# Altium project F405Flyer-ZK-v0.1.PrjPcb
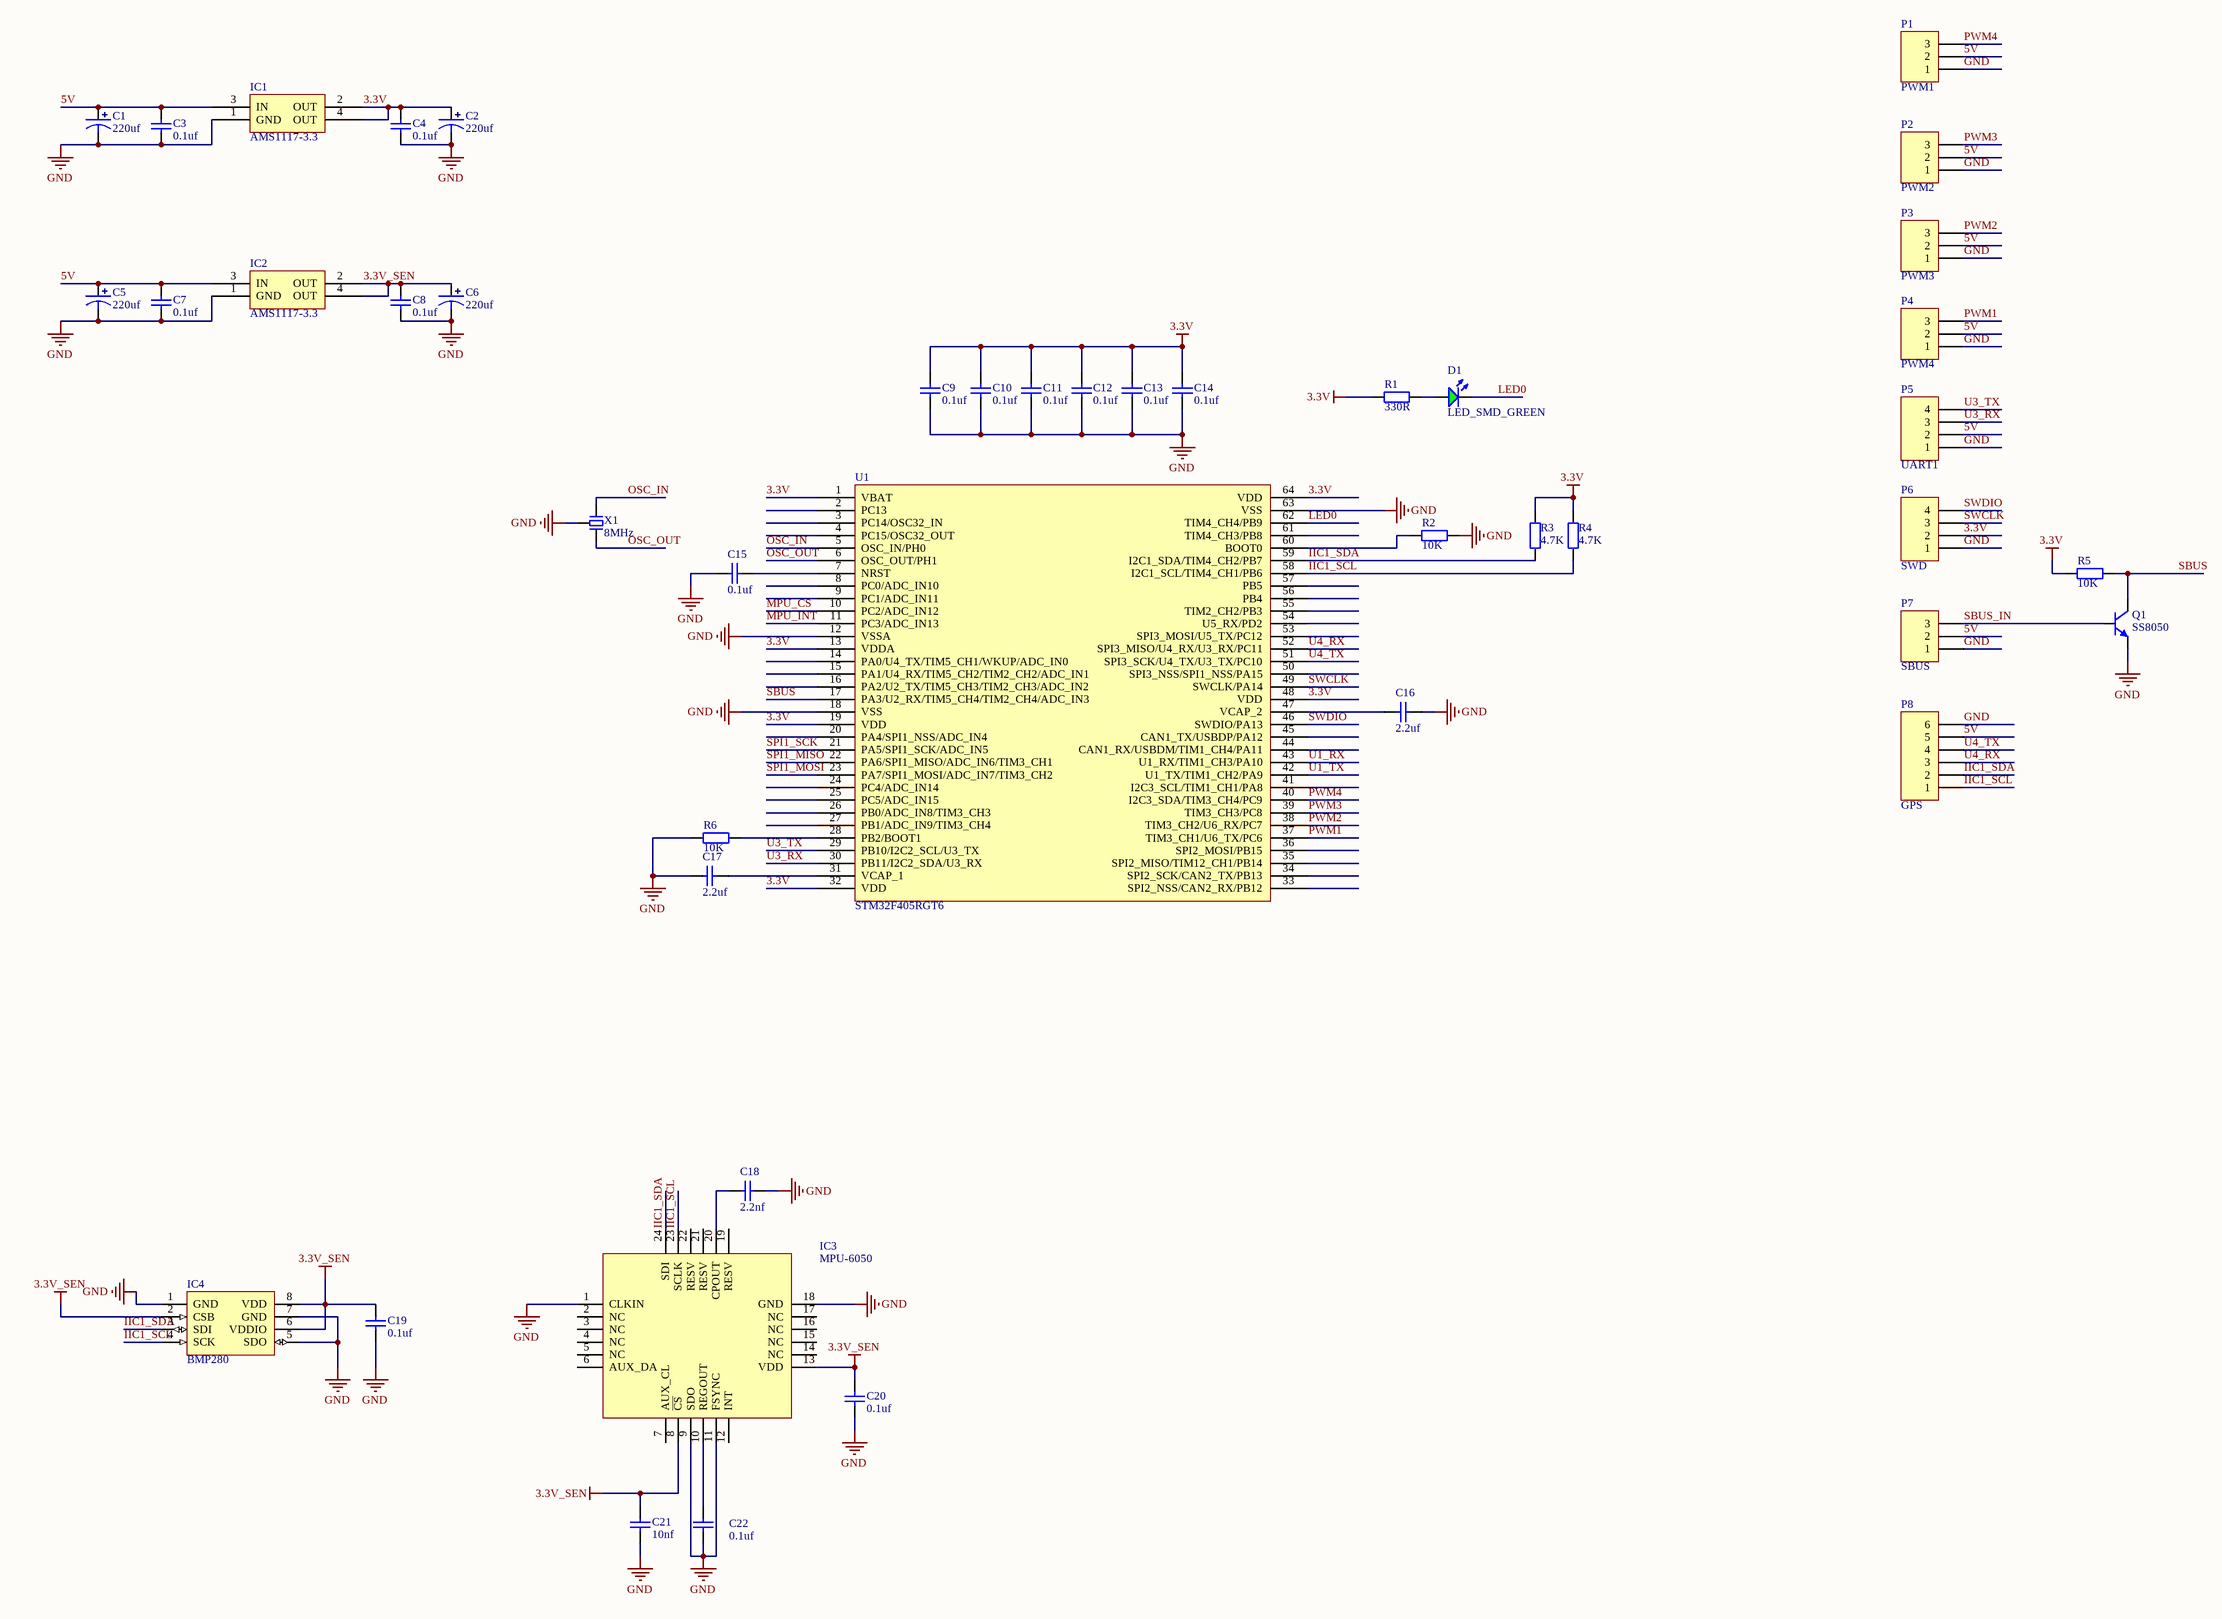
[diagram p0: 原理图.SchDoc]
1 sheet, 44 parts. Net scope: global (net labels, ports and power ports of the same name join across sheets).
Board file: V0_1MiniFlyer-ZK.PcbDoc

## Sheet 原理图.SchDoc
size A2

### Parts
C1  220uf  [CAPE_D_6.3X6.6X5.4]
C2  220uf  [CAPE_D_6.3X6.6X5.4]
C3  0.1uf  [Cap-0603]
C4  0.1uf  [Cap-0603]
C5  220uf  [CAPE_D_6.3X6.6X5.4]
C6  220uf  [CAPE_D_6.3X6.6X5.4]
C7  0.1uf  [Cap-0603]
C8  0.1uf  [Cap-0603]
C9  0.1uf  [Cap-0603]
C10  0.1uf  [Cap-0603]
C11  0.1uf  [Cap-0603]
C12  0.1uf  [Cap-0603]
C13  0.1uf  [Cap-0603]
C14  0.1uf  [Cap-0603]
C15  0.1uf  [Cap-0603]
C16  2.2uf  [Cap-0603]
C17  2.2uf  [Cap-0603]
C18  2.2nf  [Cap-0603]
C19  0.1uf  [Cap-0603]
C20  0.1uf  [Cap-0603]
C21  10nf  [Cap-0603]
C22  0.1uf  [Cap-0603]
D1  LED_SMD_GREEN  [LED_0603_G]
IC1  AMS1117-3.3  [AMS1117]
IC2  AMS1117-3.3  [AMS1117]
IC3  MPU-6050  [QFN24 4X4_N]
IC4  BMP280  [BMP280 LGA8]
P1  PWM1  [Header 2.54X3]
P2  PWM2  [Header 2.54X3]
P3  PWM3  [Header 2.54X3]
P4  PWM4  [Header 2.54X3]
P5  UART1  [Header 2.54X4]
P6  SWD  [Header 2.54X4]
P7  SBUS  [Header 2.54X3]
P8  GPS  [Header 2.54X6]
Q1  SS8050  [SOT23-3L]
R1  330R  [Res-0603-M]
R2  10K  [Res-0603-M]
R3  4.7K  [Res-0603-M]
R4  4.7K  [Res-0603-M]
R5  10K  [Res-0603]
R6  10K  [Res-0603-M]
U1  STM32F405RGT6  [LQFP64 10X10_L]
X1  8MHz  [XTAL-3215-3P]

### Nets
3.3V: C2.1 C4.2 C9.2 C10.2 C11.2 C12.2 C13.2 C14.2 IC1.2(OUT) IC1.4(OUT) P6.2 R1.2 R3.2 R4.2 R5.1 U1.1(VBAT) U1.13(VDDA) U1.19(VDD) U1.32(VDD) U1.48(VDD) U1.64(VDD)
3.3V_SEN: C6.1 C8.2 C19.2 C20.2 C21.2 IC2.2(OUT) IC2.4(OUT) IC3.8(~{CS}) IC3.13(VDD) IC4.2(CSB) IC4.6(VDDIO) IC4.8(VDD)
GND: C1.2 C2.2 C3.1 C4.1 C5.2 C6.2 C7.1 C8.1 C9.1 C10.1 C11.1 C12.1 C13.1 C14.1 C15.1 C16.2 C17.1 C18.2 C19.1 C20.1 C21.1 C22.1 IC1.1(GND) IC2.1(GND) IC3.1(CLKIN) IC3.9(SDO) IC3.11(FSYNC) IC3.18(GND) IC4.1(GND) IC4.5(SDO) IC4.7(GND) P1.1 P2.1 P3.1 P4.1 P5.1 P6.1 P7.1 P8.6 Q1.2(E) R2.2 R6.1 U1.12(VSSA) U1.18(VSS) U1.63(VSS) X1.2
5V: C1.1 C3.2 C5.1 C7.2 IC1.3(IN) IC2.3(IN) P1.2 P2.2 P3.2 P4.2 P5.2 P7.2 P8.5
IIC1_SCL: IC3.23(SCLK) IC4.4(SCK) P8.1 R4.1 U1.58(I2C1_SCL/TIM4_CH1/PB6)
IIC1_SDA: IC3.24(SDI) IC4.3(SDI) P8.2 R3.1 U1.59(I2C1_SDA/TIM4_CH2/PB7)
LED0: D1.2(K) U1.62(TIM4_CH4/PB9)
MPU_CS: U1.10(PC2/ADC_IN12)
MPU_INT: U1.11(PC3/ADC_IN13)
OSC_IN: U1.5(OSC_IN/PH0) X1.1
OSC_OUT: U1.6(OSC_OUT/PH1) X1.3
PWM1: P4.3 U1.37(TIM3_CH1/U6_TX/PC6)
PWM2: P3.3 U1.38(TIM3_CH2/U6_RX/PC7)
PWM3: P2.3 U1.39(TIM3_CH3/PC8)
PWM4: P1.3 U1.40(I2C3_SDA/TIM3_CH4/PC9)
SBUS: Q1.3(C) R5.2 U1.17(PA3/U2_RX/TIM5_CH4/TIM2_CH4/ADC_IN3)
SBUS_IN: P7.3 Q1.1(B)
SPI1_MISO: U1.22(PA6/SPI1_MISO/ADC_IN6/TIM3_CH1)
SPI1_MOSI: U1.23(PA7/SPI1_MOSI/ADC_IN7/TIM3_CH2)
SPI1_SCK: U1.21(PA5/SPI1_SCK/ADC_IN5)
SWCLK: P6.3 U1.49(SWCLK/PA14)
SWDIO: P6.4 U1.46(SWDIO/PA13)
U1_RX: U1.43(U1_RX/TIM1_CH3/PA10)
U1_TX: U1.42(U1_TX/TIM1_CH2/PA9)
U3_RX: P5.3 U1.30(PB11/I2C2_SDA/U3_RX)
U3_TX: P5.4 U1.29(PB10/I2C2_SCL/U3_TX)
U4_RX: P8.3 U1.52(SPI3_MISO/U4_RX/U3_RX/PC11)
U4_TX: P8.4 U1.51(SPI3_SCK/U4_TX/U3_TX/PC10)
NetC15_2: C15.2 U1.7(NRST)
NetC16_1: C16.1 U1.47(VCAP_2)
NetC17_2: C17.2 U1.31(VCAP_1)
NetC18_1: C18.1 IC3.20(CPOUT)
NetC22_2: C22.2 IC3.10(REGOUT)
NetD1_1: D1.1(A) R1.1
NetR2_1: R2.1 U1.60(BOOT0)
NetR6_2: R6.2 U1.28(PB2/BOOT1)

Not connected (* = marked no-connect by the designer): IC3 2(NC) 3(NC) 4(NC) 5(NC) 6(AUX_DA) 7(AUX_CL) 12(INT) 14(NC) 15(NC) 16(NC) 17(NC) 19(RESV) 21(RESV) 22(RESV); U1 2(PC13) 3(PC14/OSC32_IN) 4(PC15/OSC32_OUT) 8(PC0/ADC_IN10) 9(PC1/ADC_IN11) 14(PA0/U4_TX/TIM5_CH1/WKUP/ADC_IN0) 15(PA1/U4_RX/TIM5_CH2/TIM2_CH2/ADC_IN1) 16(PA2/U2_TX/TIM5_CH3/TIM2_CH3/ADC_IN2) 20(PA4/SPI1_NSS/ADC_IN4) 24(PC4/ADC_IN14) 25(PC5/ADC_IN15) 26(PB0/ADC_IN8/TIM3_CH3) 27(PB1/ADC_IN9/TIM3_CH4) 33(SPI2_NSS/CAN2_RX/PB12) 34(SPI2_SCK/CAN2_TX/PB13) 35(SPI2_MISO/TIM12_CH1/PB14) 36(SPI2_MOSI/PB15) 41(I2C3_SCL/TIM1_CH1/PA8) 44(CAN1_RX/USBDM/TIM1_CH4/PA11) 45(CAN1_TX/USBDP/PA12) 50(SPI3_NSS/SPI1_NSS/PA15) 53(SPI3_MOSI/U5_TX/PC12) 54(U5_RX/PD2) 55(TIM2_CH2/PB3) 56(PB4) 57(PB5) 61(TIM4_CH3/PB8)

### Library data of the parts
C1 C2 C5 C6 = CAPE-SMD: 贴片电解电容
C3 C4 C7-C22 = CAP: 贴片陶瓷电容
D1 = LED_SMD_GREEN: 发光二极管; ComponentLink1Description: 供应商链接; ComponentLink1URL: http://www.szlcsc.com/product/details_73152.html; Package: 0603; Supplier: LC; SuppliersPartNumber: C72043
IC1 IC2 = AMS1117
IC3 = MPU-6000: 传感器; ComponentLink1Description: 供应商链接; ComponentLink1URL: http://www.szlcsc.com/product/details_24852.html; Package: QFN-24_4x4x05P; Supplier: LC; SuppliersPartNumber: C24112
IC4 = BMP280: 气压传感器
P1-P4 P7 = Header_3
P5 P6 = Header_4
P8 = Header_6
Q1 = 8050-SMD: 高频放大-NPN型; 版权归属: 源创客; 属性: 40V 1.5A 1W 100MHZ; BOM名称: 高频放大-NPN型; 学习资源: www.ooocke.com
R1-R6 = RES: 贴片电阻
U1 = STM32F405RGT6: Flaah:256/RAM:48/IO:51
X1 = XTAL-3P: 3脚无源晶振; BOM名称: 2脚晶振; 版权归属: 源创客; 学习资源: www.ooocke.com